# EAGLE board EBook (EAGLE 9.7.0)
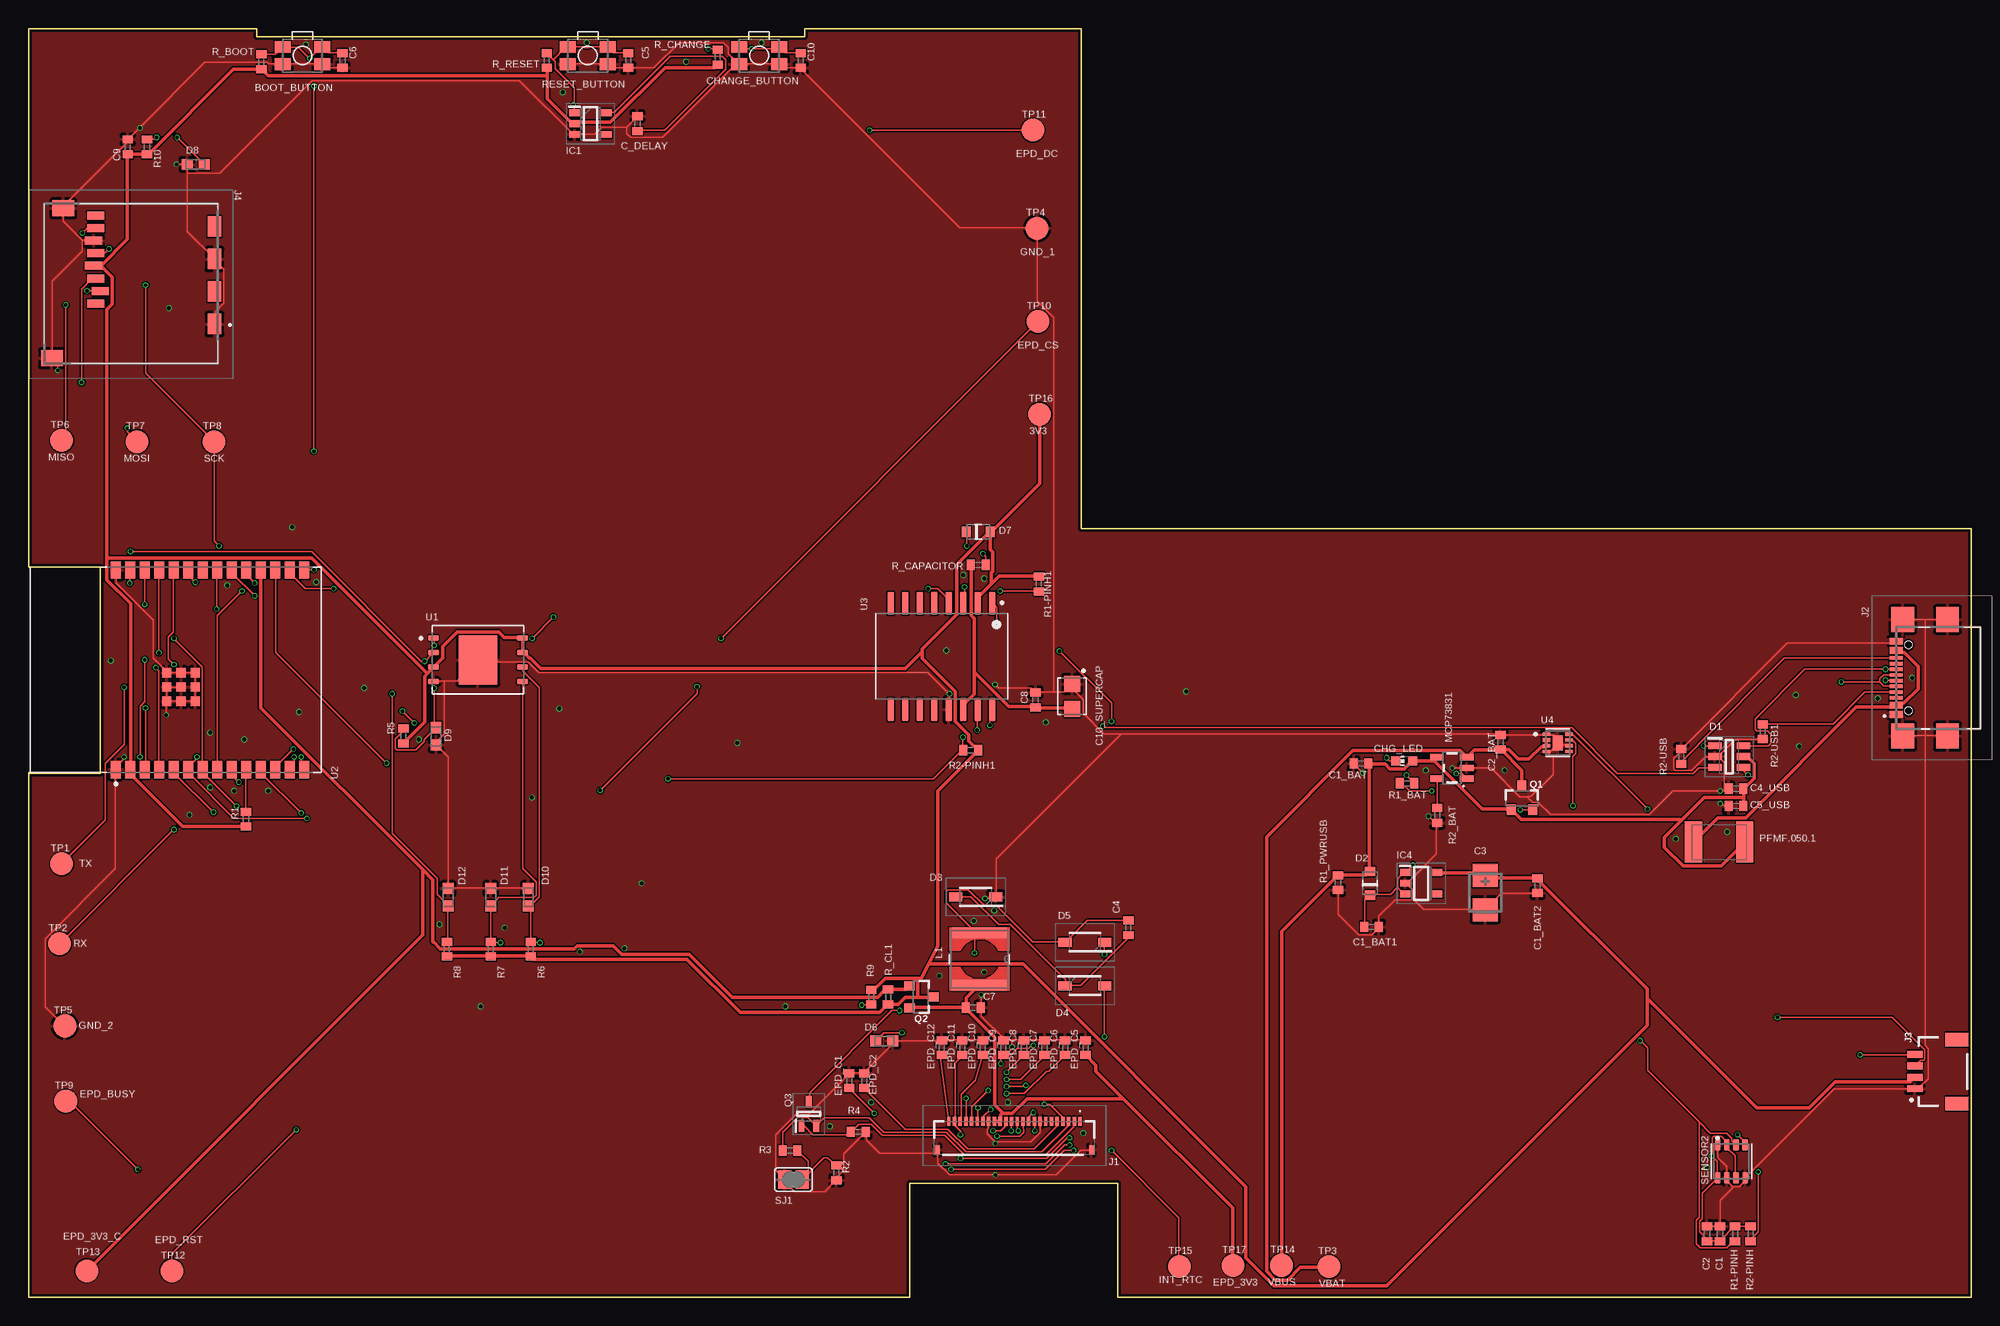
[diagram p1: board, top side]
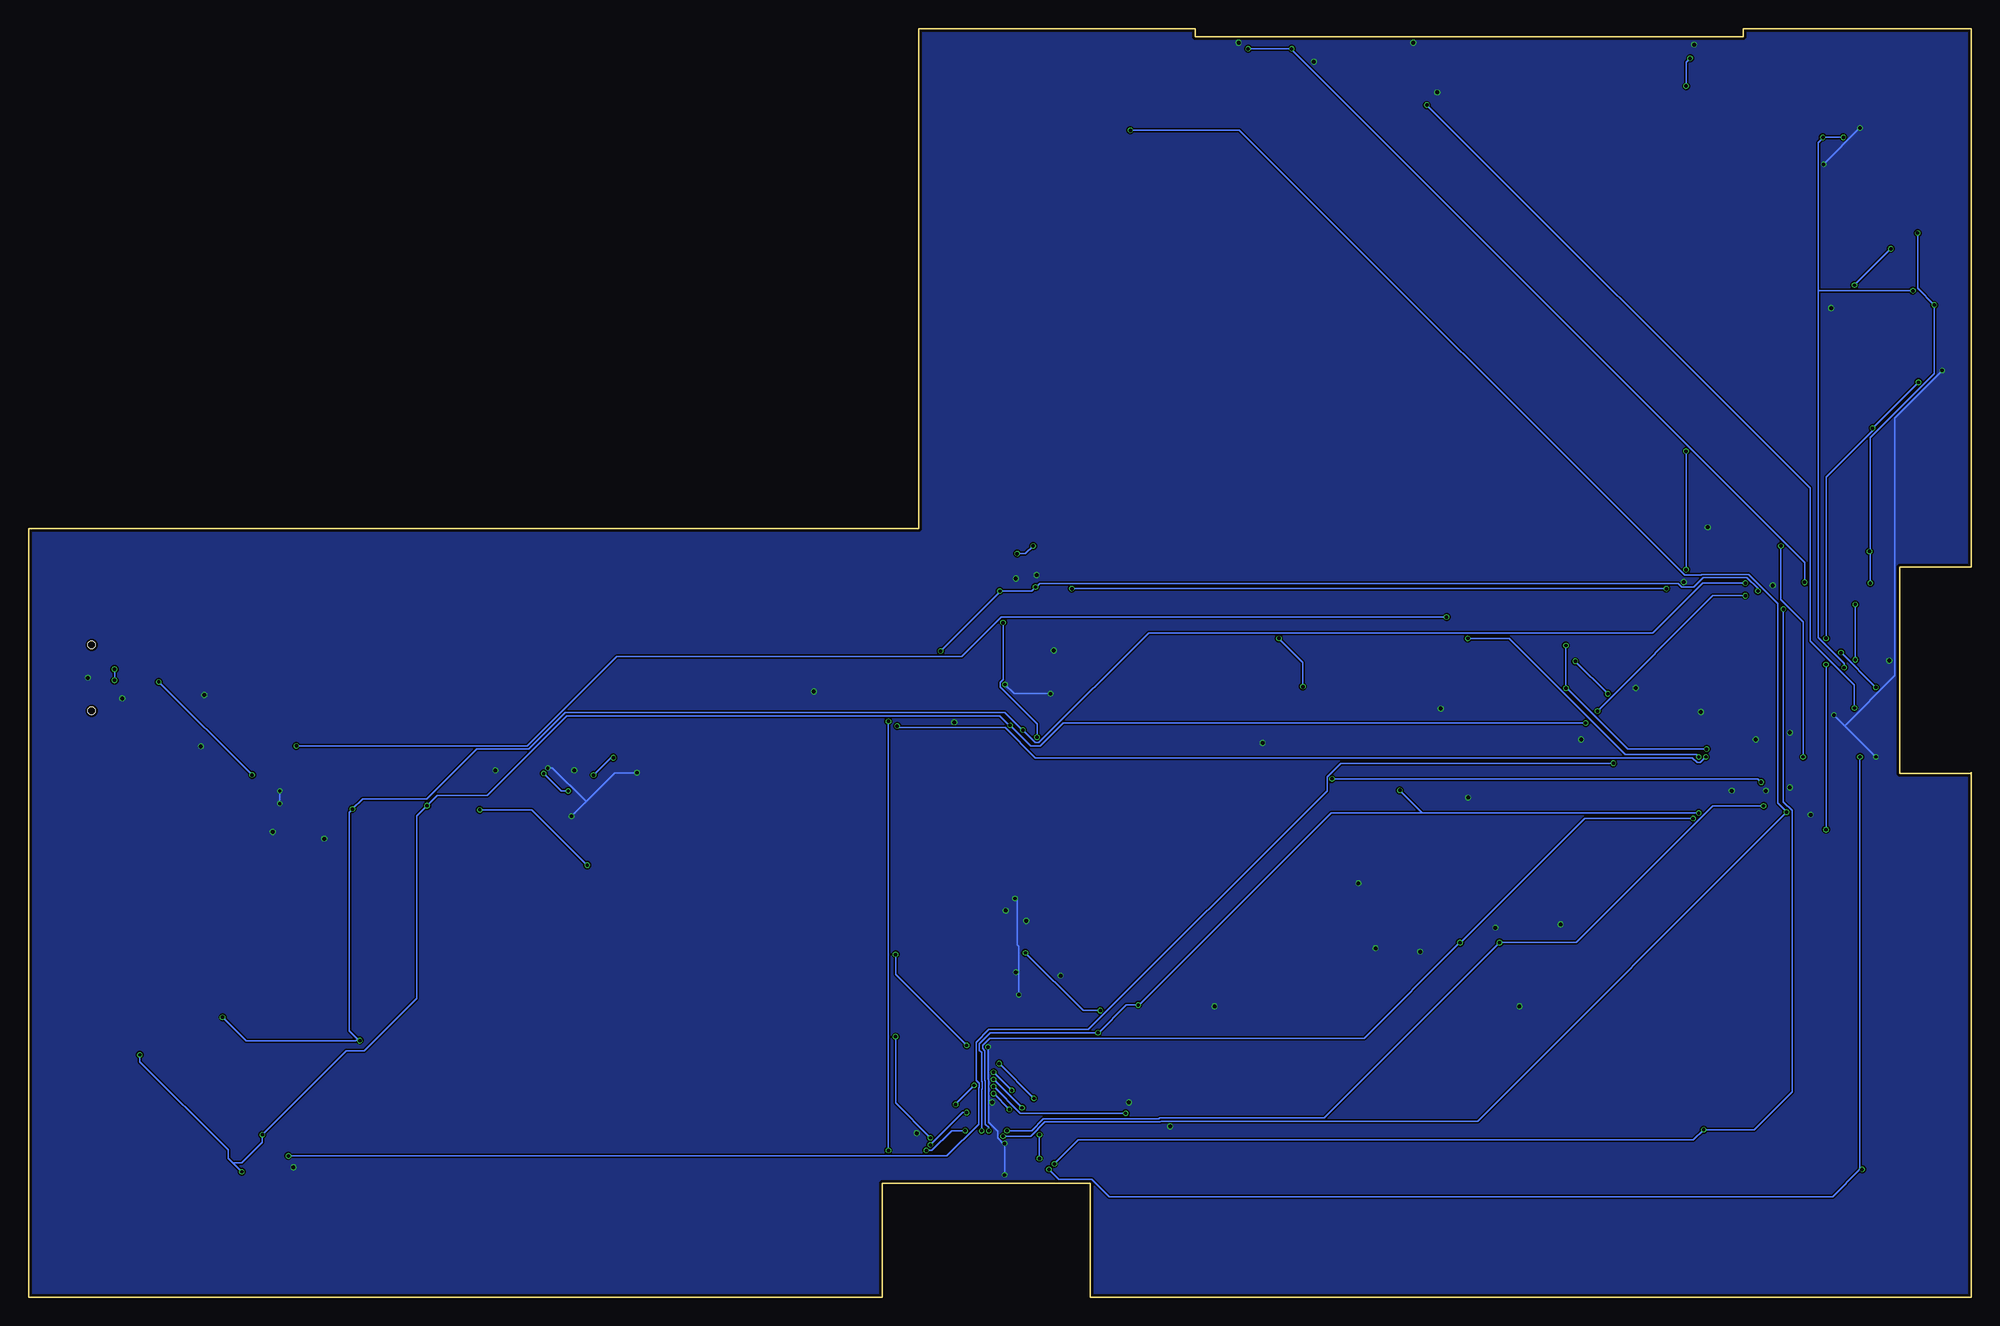
[diagram p2: board, bottom side, seen from below]

Size 170.2 x 111.2 mm. Coordinates in mm from the lower left corner, seen from the top.
Outline: 0,45.9 0,0 77.21,0 77.21,10 95.4,10 95.4,0 170.2,0 170.2,67.4 92.2,67.4 92.2,111.2 68,111.2 68,110.49 20,110.49 20,111.2 0,111.2 0,64 6.3,64 6.3,45.9 0,45.9
Outline: 0,45.9 0,46
Copper layers (1*16): Top 0.035mm / dielectric 1.6mm / Bottom 0.035mm
Design rules "jlcpcb-2layers.dru *": minimum track width 0.15mm, minimum drill 0.3mm, track to track 5mil, track to pad 5mil, pad to pad 5mil, via to via 5mil, smd to smd 5mil, copper to edge 0.2mm, drill to drill 6mil, minimum pad ring 10mil, minimum via ring 3mil, stop-mask expansion 4mil, vias tented up to drill 0mil, thermal gap 10mil
Net classes: 1 new_netclass: width 0.3 mm

## Footprints (pad centres in the part's own frame; a part is rotated, then mirrored left to right if it is on the bottom)
MYBUTTON = smd 1.4 x 1.05: 1 1.75,0.75; 2 -1.75,0.75; 3 -1.75,-0.75; 4 1.75,-0.75
EAGLE-LTSPICE_C0402 = smd 0.7 x 0.9: 1 -0.65,0; 2 0.65,0
RCL_CT3528 = smd 2 x 2.2: + -1.5,0; - 1.5,0
CAPCP3225X100N = smd 1.4 x 1.4: 1 -1.1,0; 2 1.1,0
ADAFRUIT_CHIP-LED0603 = smd 0.8 x 0.8: A 0,-0.75; C 0,0.75
SOT95P280X145-6N = smd 1.2 x 0.6: 1 -1.25,0.95; 2 -1.25,0; 3 -1.25,-0.95; 4 1.25,-0.95; 5 1.25,0; 6 1.25,0.95
ESP32_WROVER_AVX---SD0805S020S1R0_AVX_SD0805S020S1R0_0 = smd 0.8 x 0.9: 1 -1.05,0; 2 1.05,0
SOD3716X135N = smd 1.15 x 0.8: 1 -1.75,0; 2 1.75,0
DIOC1608X36N = smd 0.97 x 0.94: 1 -0.75,0; 2 0.75,0
SOT95P280X125-5N = smd 0.9 x 0.6: 1 -1.4,0.95; 2 -1.4,0; 3 -1.4,-0.95; 4 1.4,-0.95; 5 1.4,0.95
SOT95P280X120-5N = smd 0.9 x 0.6: 1 -1.4,0.95; 2 -1.4,0; 3 -1.4,-0.95; 4 1.4,-0.95; 5 1.4,0.95
FH34SRJ24S05SH99 = smd 0.3 x 0.8: 1 5.75,1.45; 2 5.25,1.45; 3 4.75,1.45; 4 4.25,1.45; 5 3.75,1.45; 6 3.25,1.45; 7 2.75,1.45; 8 2.25,1.45; 9 1.75,1.45; 10 1.25,1.45; 11 0.75,1.45; 12 0.25,1.45; 13 -0.25,1.45; 14 -0.75,1.45; 15 -1.25,1.45; 16 -1.75,1.45; 17 -2.25,1.45; 18 -2.75,1.45; 19 -3.25,1.45; 20 -3.75,1.45; 21 -4.25,1.45; 22 -4.75,1.45; 23 -5.25,1.45; 24 -5.75,1.45 | smd 0.4 x 0.8: MP1 6.75,-1.05; MP2 -6.75,-1.05
SAMACSYS_PARTS_USB4110GFA = smd 0.3 x 1.15: A1 -3.35,3.678; A4 -2.55,3.678; A5 -1.25,3.678; A6 -0.25,3.678; A7 0.25,3.678; A8 1.25,3.678; A9 2.55,3.678; A12 3.35,3.678; B1 3.05,3.678; B4 2.25,3.678; B5 1.75,3.678; B6 0.75,3.678; B7 -0.75,3.678; B8 -1.75,3.678; B9 -2.25,3.678; B12 -3.05,3.678 | smd 2.18 x 2: MP1 -5.11,-0.827; MP2 5.11,-0.827; MP3 -5.11,3.103; MP4 5.11,3.103 | hole 0.65: -2.89,2.603; 2.89,2.603
JST04_1MM_RA = smd 0.6 x 1.35: 1 -1.5,0; 2 -0.5,0; 3 0.5,0; 4 1.5,0 | smd 1.2 x 2: NC1 2.8,-3.675; NC2 -2.8,-3.675
112ATAARR03ATTEND = smd 1.8 x 1.2: G1 10.6,10.4; G2 4.9,10.4; S1 7.75,10.4; S2 2.05,10.4 | smd 1.4 x 1.9: G3 13.6,-3.85; G4 0.45,-2.85 | smd 0.7 x 1.5: P1 8.8,0; P2 7.7,0.4; P3 6.6,0; P4 5.5,-0.2; P5 4.4,0; P6 3.3,-0.2; P7 2.2,0; P8 1.1,0
IND_4828-WE-TPC_WRE = smd 0.889 x 4.826: 1 -2.286,0; 2 2.286,0
ESP32_WROVER_SPARKFUN-IC-POWER_SOT23-5 = smd 0.55 x 1.2: 1 -0.95,-1.3; 2 0,-1.3; 3 0.95,-1.3; 4 0.95,1.3; 5 -0.95,1.3
ESP32C6_VARISTOR_CT/CN1812 = smd 1.5 x 3.6: 1 -2.25,0; 2 2.25,0
ESP32_WROVER_SPARKFUN-DISCRETESEMI_SOT23-3 = smd 0.8 x 0.9: 1 -0.95,-1; 2 0.95,-1; 3 0,1.1
SOT65P210X110-3N = smd 1.05 x 0.5: 1 -1.05,0.65; 2 -1.05,-0.65; 3 1.05,0
ESP32_WROVER_EAGLE-LTSPICE_R0402 = smd 0.7 x 0.9: 1 -0.65,0; 2 0.65,0
ESP32_WROVER_BME680_PSON80P300X300X100-8N = smd 1.016 x 0.5: 1 1.458,1.2; 2 1.458,0.4; 3 1.458,-0.4; 4 1.458,-1.2; 5 -1.458,-1.22; 6 -1.458,-0.4; 7 -1.458,0.4; 8 -1.458,1.2
SJ = smd 1.168 x 1.6: 1 -0.762,0; 2 0.762,0
TP20R = smd 2 x 2: TP 0,0
SON127P600X800X80-9N = smd 0.94 x 0.44: 1 -3.895,1.905; 2 -3.895,0.635; 3 -3.895,-0.635; 4 -3.895,-1.905; 5 3.895,-1.905; 6 3.895,-0.635; 7 3.895,0.635; 8 3.895,1.905 | smd 3.4 x 4.3: 9 0,0
XCVR_ESP32-C6-WROOM-1-N8 = smd 1.5 x 0.9: 1 -8.75,5.26; 2 -8.75,3.99; 3 -8.75,2.72; 4 -8.75,1.45; 5 -8.75,0.18; 6 -8.75,-1.09; 7 -8.75,-2.36; 8 -8.75,-3.63; 9 -8.75,-4.9; 10 -8.75,-6.17; 11 -8.75,-7.44; 12 -8.75,-8.71; 13 -8.75,-9.98; 14 -8.75,-11.25; 15 8.75,-11.25; 16 8.75,-9.98; 17 8.75,-8.71; 18 8.75,-7.44; 19 8.75,-6.17; 20 8.75,-4.9; 21 8.75,-3.63; 22 8.75,-2.36; 23 8.75,-1.09; 24 8.75,0.18; 25 8.75,1.45; 26 8.75,2.72; 27 8.75,3.99; 28 8.75,5.26 | smd 0.8 x 0.8: 29_1 -2.755,0.79; 29_2 -1.505,0.79; 29_3 -0.255,0.79; 29_4 -2.755,-0.46; 29_5 -1.505,-0.46; 29_6 -0.255,-0.46; 29_7 -2.755,-1.71; 29_8 -1.505,-1.71; 29_9 -0.255,-1.71
SOIC127P1032X265-16N = smd 2.05 x 0.59: 1 -4.655,4.445; 2 -4.655,3.175; 3 -4.655,1.905; 4 -4.655,0.635; 5 -4.655,-0.635; 6 -4.655,-1.905; 7 -4.655,-3.175; 8 -4.655,-4.445; 9 4.655,-4.445; 10 4.655,-3.175; 11 4.655,-1.905; 12 4.655,-0.635; 13 4.655,0.635; 14 4.655,1.905; 15 4.655,3.175; 16 4.655,4.445
SON50P200X200X80-9N = smd 0.76 x 0.27: 1 -0.985,0.75; 4 -0.985,-0.75; 5 0.985,-0.75; 6 0.985,-0.25; 7 0.985,0.25; 8 0.985,0.75 | smd 0.76 x 0.31: 2 -0.985,0.25; 3 -0.985,-0.25 | smd 0.9 x 1.3: 9 0,0

## Placement (x,y rotation side)
BOOT_BUTTON  BUTTON_CUSYOMV1  [MYBUTTON]  24,108.83 180 top
C1  100nF  [EAGLE-LTSPICE_C0402]  148.17,5.58 90 top
C1_BAT  4.7uF  [EAGLE-LTSPICE_C0402]  116.73,46.8 180 top
C1_BAT1  4.7uF  [EAGLE-LTSPICE_C0402]  117.64,32.48 0 top
C1_BAT2  4.7uF  [EAGLE-LTSPICE_C0402]  132.18,36.08 270 top
C2  100nF  [EAGLE-LTSPICE_C0402]  147.03,5.58 90 top
C2_BAT  4.7uF  [EAGLE-LTSPICE_C0402]  128.94,48.66 90 top
C3  100uF TANT  [RCL_CT3528]  127.61,35.47 270 top
C4  4.7uF/25V  [EAGLE-LTSPICE_C0402]  96.35,32.4 90 top
C4_USB  100nF  [EAGLE-LTSPICE_C0402]  149.57,44.58 180 top
C5  1uF  [EAGLE-LTSPICE_C0402]  52.54,108.4 270 top
C5_USB  4.7uF  [EAGLE-LTSPICE_C0402]  149.57,43.08 180 top
C6  100nF  [EAGLE-LTSPICE_C0402]  27.5,108.4 270 top
C7  10uF  [EAGLE-LTSPICE_C0402]  82.75,25.4 0 top
C8  100nF  [EAGLE-LTSPICE_C0402]  88.21,52.37 90 top
C9  100nF  [EAGLE-LTSPICE_C0402]  8.7,100.83 90 top
C10  100nF  [EAGLE-LTSPICE_C0402]  67.64,108.4 270 top
C10_SUPERCAP  CPH3225A  [CAPCP3225X100N]  91.42,52.67 270 top
C_DELAY  100nF  [EAGLE-LTSPICE_C0402]  53.34,102.87 90 top
CHANGE_BUTTON  BUTTON_CUSYOMV1  [MYBUTTON]  64,108.83 180 top
CHG_LED  [ADAFRUIT_CHIP-LED0603]  120.51,47.01 90 top
D1  USBLC6-2SC6Y  [SOT95P280X145-6N]  148.98,47.4 0 top
D2  ESP32_WROVER_AVX---SD0805S020S1R0_AVX_SD0805S020S1R0_0_0AVX_SD0805S020S1R0_0_0  [ESP32_WROVER_AVX---SD0805S020S1R0_AVX_SD0805S020S1R0_0]  117.51,36.3 90 top
D3  MBR0530  [SOD3716X135N]  82.98,35.11 180 top
D4  MBR0530  [SOD3716X135N]  92.54,27.32 0 top
D5  MBR0530  [SOD3716X135N]  92.54,31.13 180 top
D6  PGB1010603MR  [DIOC1608X36N]  74.97,22.48 180 top
D7  ESP32_WROVER_AVX---SD0805S020S1R0_AVX_SD0805S020S1R0_0_0AVX_SD0805S020S1R0_0_0  [ESP32_WROVER_AVX---SD0805S020S1R0_AVX_SD0805S020S1R0_0]  83.2,67.1 0 top
D8  PGB1010603MR  [DIOC1608X36N]  14.65,99.28 0 top
D9  PGB1010603MR  [DIOC1608X36N]  35.7,49.18 90 top
D10  PGB1010603MR  [DIOC1608X36N]  43.78,35.08 270 top
D11  PGB1010603MR  [DIOC1608X36N]  40.49,35.08 270 top
D12  PGB1010603MR  [DIOC1608X36N]  36.77,35.08 270 top
EPD_C1  1uF/50V  [EAGLE-LTSPICE_C0402]  71.9,19 90 top
EPD_C2  1uF/50V  [EAGLE-LTSPICE_C0402]  73.2,19 90 top
EPD_C5  0.1uF/50V  [EAGLE-LTSPICE_C0402]  92.6,21.89 90 top
EPD_C6  1uF/50V  [EAGLE-LTSPICE_C0402]  90.8,21.89 90 top
EPD_C7  1uF/50V  [EAGLE-LTSPICE_C0402]  89,21.89 90 top
EPD_C8  1uF/50V  [EAGLE-LTSPICE_C0402]  87.2,21.89 90 top
EPD_C9  1uF/50V  [EAGLE-LTSPICE_C0402]  85.4,21.89 90 top
EPD_C10  1uF/50V  [EAGLE-LTSPICE_C0402]  83.6,21.89 90 top
EPD_C11  1uF/50V  [EAGLE-LTSPICE_C0402]  81.8,21.89 90 top
EPD_C12  1uF/50V  [EAGLE-LTSPICE_C0402]  80.01,21.89 90 top
IC1  BD5229G-TR  [SOT95P280X125-5N]  49.23,102.87 0 top
IC4  XC6220A331MR-G  [SOT95P280X120-5N]  122,36.3 0 top
J1  FH34SRJ-24S-0.5SH_99_  [FH34SRJ24S05SH99]  86.36,13.97 0 top
J2  SAMACSYS_PARTS_USB4110-GF-A  [SAMACSYS_PARTS_USB4110GFA]  167.28,54.3 90 top
J3  QWIIC_RIGHT_ANGLE  [JST04_1MM_RA]  165.25,19.8 90 top
J4  112A-TAAR-R03_ATTEND  [112ATAARR03ATTEND]  5.89,95.9 270 top
L1  68uH  [IND_4828-WE-TPC_WRE]  83.3,29.65 270 top
MCP73831  ESP32_WROVER_SPARKFUN-IC-POWER_MCP73831  [ESP32_WROVER_SPARKFUN-IC-POWER_SOT23-5]  124.69,46.4 90 top
PFMF.050.1  ESP32C6_VARISTORCN1812  [ESP32C6_VARISTOR_CT/CN1812]  148.1,39.91 0 top
Q1  20V/4.2A/52mΩ/1.4W  [ESP32_WROVER_SPARKFUN-DISCRETESEMI_SOT23-3]  130.82,43.74 0 top
Q2  20V/4.2A/52mΩ/1.4W  [ESP32_WROVER_SPARKFUN-DISCRETESEMI_SOT23-3]  78.17,26.34 270 top
Q3  SI1308EDL-T1-GE3  [SOT65P210X110-3N]  68.35,16.08 90 top
R1  10K  [ESP32_WROVER_EAGLE-LTSPICE_R0402]  19.05,41.91 90 top
R1-PINH  10K  [ESP32_WROVER_EAGLE-LTSPICE_R0402]  149.49,5.58 90 top
R1-PINH1  10K  [ESP32_WROVER_EAGLE-LTSPICE_R0402]  88.51,62.53 90 top
R1_BAT  200  [ESP32_WROVER_EAGLE-LTSPICE_R0402]  120.75,45.06 0 top
R1_PWRUSB  100K  [ESP32_WROVER_EAGLE-LTSPICE_R0402]  114.71,36.35 90 top
R2  2.2  [ESP32_WROVER_EAGLE-LTSPICE_R0402]  70.77,10.93 90 top
R2-PINH  10K  [ESP32_WROVER_EAGLE-LTSPICE_R0402]  150.85,5.58 90 top
R2-PINH1  10K  [ESP32_WROVER_EAGLE-LTSPICE_R0402]  82.53,47.96 0 top
R2-USB  5k1  [ESP32_WROVER_EAGLE-LTSPICE_R0402]  144.78,47.4 90 top
R2-USB1  5k1  [ESP32_WROVER_EAGLE-LTSPICE_R0402]  151.92,49.58 90 top
R2_BAT  2K  [ESP32_WROVER_EAGLE-LTSPICE_R0402]  123.4,42.24 90 top
R3  0.47  [ESP32_WROVER_EAGLE-LTSPICE_R0402]  66.71,12.87 0 top
R4  10K  [ESP32_WROVER_EAGLE-LTSPICE_R0402]  72.68,14.51 0 top
R5  10K  [ESP32_WROVER_EAGLE-LTSPICE_R0402]  32.84,49.2 270 top
R6  10K  [ESP32_WROVER_EAGLE-LTSPICE_R0402]  44,30.52 270 top
R7  10K  [ESP32_WROVER_EAGLE-LTSPICE_R0402]  40.48,30.52 270 top
R8  10K  [ESP32_WROVER_EAGLE-LTSPICE_R0402]  36.65,30.52 270 top
R9  10K  [ESP32_WROVER_EAGLE-LTSPICE_R0402]  73.82,26.32 90 top
R10  10K  [ESP32_WROVER_EAGLE-LTSPICE_R0402]  10.38,100.83 270 top
R_BOOT  10K  [ESP32_WROVER_EAGLE-LTSPICE_R0402]  20.4,108.28 90 top
R_CAPACITOR  15  [ESP32_WROVER_EAGLE-LTSPICE_R0402]  83.2,64.2 0 top
R_CHANGE  10K  [ESP32_WROVER_EAGLE-LTSPICE_R0402]  60.38,108.7 90 top
R_CL1  10K  [ESP32_WROVER_EAGLE-LTSPICE_R0402]  75.3,26.34 90 top
R_RESET  10K  [ESP32_WROVER_EAGLE-LTSPICE_R0402]  45.4,108.4 90 top
RESET_BUTTON  BUTTON_CUSYOMV1  [MYBUTTON]  49,108.83 180 top
SENSOR2  ESP32_WROVER_BME680_BME680  [ESP32_WROVER_BME680_PSON80P300X300X100-8N]  149.17,11.93 90 top
SJ1  [SJ]  67.01,10.33 0 top
TP1  TPTP20R  [TP20R]  2.9,38 0 top
TP2  TPTP20R  [TP20R]  2.72,31 0 top
TP3  TPTP20R  [TP20R]  113.94,2.7 0 top
TP4  TPTP20R  [TP20R]  88.36,93.7 0 top
TP5  TPTP20R  [TP20R]  3.18,23.8 0 top
TP6  TPTP20R  [TP20R]  2.9,75.1 0 top
TP7  TPTP20R  [TP20R]  9.52,75 0 top
TP8  TPTP20R  [TP20R]  16.24,75 0 top
TP9  TPTP20R  [TP20R]  3.26,17.2 0 top
TP10  TPTP20R  [TP20R]  88.41,85.52 0 top
TP11  TPTP20R  [TP20R]  87.98,102.3 0 top
TP12  TPTP20R  [TP20R]  12.56,2.32 0 top
TP13  TPTP20R  [TP20R]  5.11,2.32 0 top
TP14  TPTP20R  [TP20R]  109.76,2.82 0 top
TP15  TPTP20R  [TP20R]  100.81,2.72 0 top
TP16  TPTP20R  [TP20R]  88.58,77.4 0 top
TP17  TPTP20R  [TP20R]  105.53,2.8 0 top
U1  W25Q512JVEIQ  [SON127P600X800X80-9N]  39.37,55.88 0 top
U2  ESP32-C6-WROOM-1-N8  [XCVR_ESP32-C6-WROOM-1-N8]  12.9,55 90 top
U3  DS3231SN#  [SOIC127P1032X265-16N]  79.99,56.18 270 top
U4  MAX17048G+T10  [SON50P200X200X80-9N]  133.96,48.6 0 top

## Tracks (layer width: path | path; a pad name or v marks a point on that pad's centre or on a via)
3V3
  Top 0.3: 45.43,107.06 45.43,107.68 R_RESET.1 | 45.43,107.06 45.43,105.05 47.58,102.91 47.78,102.91 IC1.2 47.92,102.97 50.97,102.97 55.77,107.77 60.1,107.77 R_CHANGE.1 | 43.28,56.6 43.28,57.76 U1.8 43.14,57.82 41.69,57.82 41.2,58.31 37.53,58.31 36.29,57.06 36.29,56.02 35.59,55.33 U1.3 35.46,55.19 34.94,54.67 | 43.28,56.6 43.28,56.58 U1.7 | 34.94,54.67 34.69,54.43 34.69,50.41 32.89,48.61 R5.2 | R1.1 19.04,41.27 13.5,41.27 8.93,45.84 8.93,46.19 U2.2 8.93,46.4 8.93,60.8 6.86,62.88 6.86,64.82 | 6.86,64.82 6.86,86.56 7.34,87.05 7.34,89.4 6.44,90.3 J4.P4 5.75,90.44 6.37,90.44 8.66,92.73 8.66,100.07 C9.1 8.73,100.2 10.32,100.2 R10.2 10.53,100.2 17.94,107.61 20.36,107.61 R_BOOT.1 20.5,107.55 20.98,107.06 45.43,107.06 | 34.94,54.67 24.79,64.82 6.86,64.82 | IC4.5 123.4,37.19 127.35,37.19 127.56,36.98 C3.+ 127.7,36.91 127.83,36.77 132.13,36.77 C1_BAT2.1 132.18,36.62 141.78,27.02 141.78,26.22 | 141.78,26.22 151.38,16.62 156.01,16.62 158.26,18.88 164.83,18.88 J3.2 | R8.2 36.7,29.92 40.44,29.92 R7.2 40.58,29.92 43.97,29.92 R6.2 44.23,29.64 57.68,29.64 62.35,24.97 74.56,24.97 75.21,25.62 R_CL1.1 75.34,25.69 76.17,25.69 76.8,26.32 77.91,26.32 | 77.91,26.32 79.22,26.32 Q2.3 | 77.77,27.98 78.22,27.98 78.84,29.22 | 77.77,27.98 75.07,27.98 74.1,27.01 73.82,27.01 R9.2 | 77.77,27.98 77.91,27.84 77.91,26.32 | D7.2 84.21,67.1 81.32,64.22 81.32,59.86 78.3,56.84 78.3,56.6 | R1-PINH1.2 88.5,63.23 85.04,63.23 84.35,62.53 | TP16.TP 88.57,77.35 88.57,71.33 84.42,67.17 D7.2 | 84.35,62.53 83.17,61.35 83.17,60.87 U3.2 | 78.84,29.22 79.64,30.82 79.64,44.39 83.1,47.85 R2-PINH1.2 82.36,48.78 82.36,49.31 81.2,50.47 81.2,53.1 78.3,55.99 78.3,56.6
  Top 0.3: 78.84,29.22 87.12,29.22 106.64,9.7 106.64,3.46 109.07,1.04 118.99,1.04 141.78,23.82 141.78,26.22 | 84.35,62.53 84.35,63.51 84.48,63.63 84.48,65.33 84.25,65.55 D7.2 | 43.28,56.6 43.86,56.02 43.93,56.02 44.85,55.1 76.8,55.1 78.3,56.6
32KHZ  (via drill 0.3)
  Top 0.15: v81.85,49.1 81.85,47.99 R2-PINH1.1 81.78,47.99 79.25,45.45 v56.02,45.45 | v84.83,59.14 84.83,60.45 84.48,60.8 U3.1 | v18.42,45.15 17.87,45.7 17.87,46.19 U2.9
  Bottom 0.15: v81.85,49.1 81.85,50.28 85.1,53.52 85.1,53.89 84.83,54.16 v84.83,59.14 | v56.02,45.45 18.72,45.45 v18.42,45.15
DN  (via drill 0.3)
  Top 0.15: 162.18,53.95 162.53,53.6 163.57,53.6 J2.B7 | 162.18,53.95 162.18,54.22 162.53,54.57 163.57,54.57 J2.A7 | v150.62,45.77 150.27,46.12 150.27,46.4 D1.4 | 162.18,53.95 v158.79,53.95
  Bottom 0.15: v158.79,53.95 v150.62,45.77
DP  (via drill 0.3)
  Top 0.15: v162.67,54.08 163.57,54.08 J2.A6 | J2.B6 163.57,55.05 v162.67,55.05 155.6,55.05 151.24,50.69 151.24,49.79 151.38,49.65 152.35,49.65 152.63,49.38 152.63,48.54 152.42,48.34 150.27,48.34 D1.6
  Bottom 0.15: v162.67,55.05 v162.67,54.08
EPD_3V3
  Top 0.3: Q2.2 77.21,25.41 82.06,25.41 C7.1 | C7.1 82.13,25.55 82.13,26.25 83.24,27.35 L1.2 | J1.16 84.62,15.44 85.11,15.44 J1.15 85.18,15.58 85.18,16 85.32,16.14 | EPD_C5.1 93.5,20.34 93.5,19.82 95.9,17.41 | 95.9,17.41 105.47,7.85 105.47,2.84 TP17.TP | C7.1 82.13,25.28 84.62,22.78 84.62,16.9 85.25,16.27 85.32,16.14 | 95.9,17.41 87.47,17.41 86.19,16.14 85.32,16.14
EPD_3V3_C
  Top 0.3: Q2.1 77.14,27.29 76.87,27.01 75.34,27.01 R_CL1.2 75.21,26.87 74.93,26.87 74.37,26.32 61.63,26.32 57.88,30.07 51.98,30.07 51.23,30.83 48.08,30.83 47.8,30.54 36.09,30.54 35.49,31.14 35.43,31.14 35.43,36.59 34.53,37.49 | 34.53,37.49 20.36,51.66 20.36,63.71 U2.18 | 34.53,37.49 34.53,31.76 5.12,2.35 TP13.TP
EPD_BUSY  (via drill 0.3)
  Top 0.15: v88.16,14.61 88.16,15.37 J1.9 | v91.55,12.88 90.72,12.88 89.06,11.22 v80.81,11.22 | v9.58,11.22 3.83,16.97 TP9.TP | v10.18,60.73 10.18,63.71 U2.26 | v10.18,55.88 10.18,52.22 9.76,51.8 v9.76,47.37
  Bottom 0.15: v88.16,14.61 89.33,14.61 91.06,12.88 v91.55,12.88 | v9.58,11.22 9.76,11.22 | v10.18,55.88 v10.18,60.73 | 9.76,11.22 v9.76,47.37 | v80.81,11.22 79.95,10.35 77.06,10.35 75.53,8.82 12.16,8.82 9.76,11.22
EPD_CS  (via drill 0.3)
  Top 0.15: v86.7,14.61 86.63,14.68 86.63,15.37 J1.12 | v76.52,23.2 74.93,23.2 74.24,22.51 D6.2 | v72.99,25.62 73.75,25.62 R9.1 | v23.89,42.45 20.36,45.98 20.36,46.19 U2.11 | v60.66,57.76 88.36,85.45 TP10.TP | v58.56,53.53 58.56,52.93 v50.07,44.44
  Bottom 0.15: 48.11,42.45 56.09,42.45 72.92,25.62 v72.99,25.62 74.03,25.62 76.45,23.2 v76.52,23.2 85.94,23.2 86.91,22.23 86.91,21.68 86.7,21.47 86.7,18.93 86.66,18.88 86.66,18.3 86.7,18.25 v86.7,14.61 | 48.11,42.45 v23.89,42.45 | v60.66,57.76 58.56,55.65 v58.56,53.53 | v50.07,44.44 48.11,42.47 48.11,42.45
EPD_DC  (via drill 0.3)
  Top 0.15: v84.83,14.13 86.84,14.13 87.19,14.47 87.19,14.75 87.12,14.82 87.12,15.37 J1.11 | v16.2,42.52 12.74,45.98 12.74,46.19 U2.5 | v73.68,102.28 87.95,102.28 TP11.TP
  Bottom 0.15: v84.83,14.13 82.41,14.13 81.16,15.37 71.07,15.37 70.99,15.45 43.27,15.45 v16.2,42.52 16.2,42.59 16.97,43.35 16.97,60.8 19.53,63.36 23.61,63.36 23.68,63.29 25.14,63.29 64.13,102.28 v73.68,102.28
EPD_RST  (via drill 0.3)
  Top 0.15: v88.02,16.2 87.67,15.86 87.67,15.44 J1.10 | v91.2,13.37 90.79,13.37 89.12,11.7 v80.33,11.7 | v23.45,14.7 12.56,3.81 TP12.TP | v16.48,60.32 16.48,63.71 U2.21
  Bottom 0.15: v88.02,16.2 88.36,16.2 v91.2,13.37 | v80.33,11.7 78.23,13.8 24.35,13.8 v23.45,14.7 19.02,14.7 15.72,18 15.72,42.66 16.48,43.42 v16.48,60.32
FLASH_CS  (via drill 0.3)
  Top 0.15: R5.1 32.83,49.79 32.83,49.65 32.13,48.96 32.13,48.13 32.27,47.99 33.93,47.99 34.65,48.71 34.65,48.88 D9.2 35.66,50 35.52,50.14 v35.52,53.39 | v35.52,57.13 35.52,57.76 U1.1 | v23.2,48.06 21.68,46.54 21.68,46.26 U2.12
  Bottom 0.15: v35.52,57.13 v35.52,53.39 35.46,53.39 30.12,48.06 v23.2,48.06
GDR
  Top 0.15: J1.2 91.55,15.37 91.55,14.96 89.06,12.46 81.99,12.46 80.26,14.2 74.79,14.2 73.82,15.17 72.71,15.17 72.09,14.54 R4.1 72.02,14.47 71.81,14.27 68.7,14.27 67.93,15.03 67.73,15.03 Q3.1
GND  (via drill 0.3, 0.35)
  Top 0.15: U2.29_1 12.12,52.28 12.12,53.46 U2.29_2 12.19,53.46 13.3,53.46 U2.29_5 | U2.29_1 12.19,52.28 13.3,52.28 U2.29_4 13.37,52.28 14.54,52.28 U2.29_7 14.61,52.28 14.61,53.46 U2.29_8 14.61,53.53 14.61,54.71 U2.29_9 14.54,54.78 13.37,54.78 U2.29_6 13.3,54.78 12.12,54.78 U2.29_3 12.12,54.85 10.94,56.02 10.94,59.35 7.69,62.6 7.69,63.71 U2.28 | TP5.TP 3.12,23.82 1.45,25.48 1.45,31.44 7.62,37.6 7.62,46.19 U2.1 7.69,46.26 7.69,46.54 8.38,47.23 v8.38,47.37 | v12.05,51.04 12.05,52.22 U2.29_1 | 13.92,98.54 13.92,93.42 16.27,91.06 J4.G2 16.27,90.92 17.11,90.09 17.11,87.12 16.34,86.36 16.34,85.32 J4.G1 | 13.92,98.54 13.92,99.23 D8.1 13.85,99.31 v12.95,99.31 | C6.2 26.04,107.75 25.76,108.03 BOOT_BUTTON.2 25.69,108.1 22.3,108.1 BOOT_BUTTON.1 22.23,108.1 21.05,108.1 20.91,108.24 15.44,108.24 9.73,102.53 | 4.71,92.66 5.68,92.66 J4.P6 | 4.71,92.66 3.05,94.32 3.05,95.43 J4.G4 3.05,95.5 3.05,95.63 8.66,101.24 8.66,101.45 C9.2 8.73,101.52 9.73,102.53 | 4.71,92.66 4.71,91.69 2.08,89.06 2.08,82.34 J4.G3 2.08,82.27 2.56,81.78 v2.56,81.23 | v9.76,102.49 9.73,102.53 | 52.42,102.56 50.21,102.56 49.58,101.94 47.85,101.94 IC1.3 47.78,101.87 43,106.64 24.86,106.64 16.76,98.54 13.92,98.54 | 52.42,102.56 53.32,103.46 C_DELAY.2 | RESET_BUTTON.1 47.3,108.1 50.69,108.1 RESET_BUTTON.2 50.76,108.03 51.04,107.75 52.49,107.75 C5.2 52.56,107.75 54.78,107.75 56.99,109.97 60.87,109.97 61.29,109.55 61.29,109 62.19,108.1 CHANGE_BUTTON.1 | CHANGE_BUTTON.1 62.26,108.1 65.72,108.1 CHANGE_BUTTON.2 65.79,108.03 66.06,107.75 67.59,107.75 C10.2 67.66,107.68 81.58,93.76 88.29,93.76 TP4.TP 88.36,93.63 88.36,87.32 89.82,85.87 89.82,53.05
  Top 0.15: 52.42,102.56 52.42,102 52.77,101.66 55.54,101.66 62.05,108.17 CHANGE_BUTTON.1 | EPD_C10.2 83.58,22.58 81.85,22.58 EPD_C11.2 81.78,22.58 80.05,22.58 EPD_C12.2 79.98,22.51 75.76,22.51 D6.1 75.69,22.44 75.69,22.23 73.2,19.74 EPD_C2.2 73.2,19.67 71.95,19.67 EPD_C1.2 71.88,19.6 68.35,16.07 67.24,16.07 65.44,14.27 65.44,11.15 66.2,10.39 SJ1.1 66.27,10.32 66.27,10.11 67.1,9.28 69.73,9.28 70.7,10.25 R2.1 70.77,10.49 71.42,11.15 71.42,12.6 R4.2 73.45,13.76 74.56,12.65 79.34,12.65 J1.MP2 79.64,12.88 79.64,11.77 80.68,10.73 v84.69,10.73 90.03,10.73 92.17,12.88 93.07,12.88 J1.MP1 | 86.15,22.58 87.19,22.58 EPD_C8.2 87.25,22.58 88.99,22.58 EPD_C7.2 89.06,22.58 90.79,22.58 EPD_C6.2 90.86,22.58 92.59,22.58 EPD_C5.2 | 86.15,22.58 85.45,22.58 EPD_C9.2 85.45,22.64 83.45,24.65 83.45,25.35 C7.2 83.45,25.41 v83.45,26.52 | 84.69,13.64 84,14.34 84,14.75 84.07,14.82 84.07,15.37 J1.17 | 84.69,13.64 87.81,13.64 88.64,14.47 88.64,15.37 J1.8 | 84.69,13.64 v84.69,13.5 | v86.15,21.95 86.15,22.58 | D10.1 43.77,35.87 40.51,35.87 D11.1 40.44,35.87 36.77,35.87 D12.1 36.77,35.94 36.77,47.37 35.73,48.41 D9.1 35.73,48.48 35.73,48.68 36.42,49.38 36.42,54.02 | 36.42,54.02 37.53,54.02 39.33,55.82 U1.9 39.58,55.67 43.79,55.67 44.7,54.75 78.77,54.75 80.61,52.91 v80.68,52.91 80.68,51.59 U3.13 | 36.42,54.02 35.52,54.02 U1.4 | 89.82,53.05 90.72,53.05 91.41,53.74 C10_SUPERCAP.1 91.27,53.53 92.38,52.42 92.38,51.2 94.2,49.38 95.72,49.38 | 89.82,53.05 88.22,53.05 C8.2 88.16,53.05 87.81,53.39 84.99,53.39 v84.67,53.71 | 95.72,49.38 84.76,38.41 84.76,35.18 D3.1 84.69,35.11 84.55,34.97 v83.79,34.97
  Top 0.15: C1_BAT2.2 132.13,35.39 129.01,35.39 127.63,34 C3.- 127.56,34 122.23,34 121.33,34.9 121.26,34.9 | 121.26,34.9 121.26,35.73 120.63,36.36 IC4.2 120.77,36.29 123.33,38.85 123.33,41.55 R2_BAT.1 123.27,41.55 v122.64,42.17 | R1_PWRUSB.1 114.75,35.66 114.75,33.59 116.55,31.79 117.66,31.79 118.28,32.41 C1_BAT1.2 118.29,33.44 119.7,34.85 121.13,34.85 121.19,34.9 121.26,34.9 | v116.89,45.98 116.13,46.74 C1_BAT.2 | C2.2 147.09,6.23 148.13,6.23 C1.2 148.19,6.3 148.19,8.52 149.3,9.63 149.3,9.7 | 149.3,9.7 148.82,10.18 148.82,10.46 SENSOR2.7 148.75,10.53 148.75,11.49 147.99,12.26 147.99,13.37 SENSOR2.1 | 149.3,9.7 149.86,9.7 150.34,10.18 150.34,10.46 SENSOR2.5 150.41,10.53 158.17,18.28 165.23,18.28 J3.1 165.3,18.35 165.58,18.35 166.4,19.18 166.4,21.8 166.13,22.07 166.13,49.24 | J2.B12 163.64,51.24 163.64,50.97 J2.A1 163.64,50.9 163.64,49.72 164.12,49.24 J2.MP3 164.19,49.24 166.13,49.24 | 166.13,49.24 168.07,49.24 J2.MP1 | 166.13,59.42 164.19,59.42 J2.MP4 164.12,59.35 163.64,58.86 163.64,57.69 J2.A12 163.64,57.62 163.64,57.41 J2.B1 163.57,57.34 154.08,57.34 144.8,48.06 R2-USB.2 144.73,47.99 144.73,47.85 144.11,47.23 144.11,46.33 144.25,46.19 145.7,46.19 146.88,47.37 147.71,47.37 D1.2 | 166.13,59.42 168.07,59.42 J2.MP2 | 166.13,59.42 166.13,49.24 | v148.19,43.28 148.33,43.14 148.89,43.14 C5_USB.2 | 148.54,44.39 148.75,44.39 148.89,44.53 C4_USB.2 | 148.54,44.39 v148.19,44.39 144.04,44.39 141.96,42.31 133.33,42.31 132.25,43.39 131.79,43.39 131.3,43.88 | R2-USB1.1 151.87,48.89 149.51,48.89 148.06,47.44 147.78,47.44 D1.2 | 148.54,44.39 148.54,46.88 148.06,47.37 D1.2
  Top 0.15: U4.9 134,48.54 133.31,47.85 133.03,47.85 U4.4 133.56,47.27 133.56,45.84 131.6,43.89 131.3,43.89 131.3,43.88 | U4.9 134.22,48.69 133.61,49.31 133.03,49.31 U4.1 132.96,49.31 C2_BAT.2 128.87,49.38 95.72,49.38 | U4.6 134.9,48.41 134.21,48.41 134.07,48.54 U4.9 | 131.3,43.88 130.63,43.88 128.11,46.4 126.03,46.4 MCP73831.2 125.97,46.4 v124.72,46.4
  Bottom 0.15: v8.38,47.37 11.12,50.1 | 11.12,50.1 v12.05,51.04 | v9.76,102.49 v12.95,99.31 | 11.12,50.1 6.72,54.5 6.72,77.08 v2.56,81.23 | v84.69,10.73 v84.69,13.5 84.76,13.43 85.32,13.99 85.32,14.54 86.1,15.33 86.1,19.11 86.15,19.16 v86.15,21.95 | v80.68,52.91 83.86,52.91 v84.67,53.71 | v116.89,45.98 118.83,45.98 121.36,43.45 | v122.64,42.17 121.36,43.45 | v148.19,44.39 v148.19,43.28 | 121.36,43.45 124.3,46.4 v124.72,46.4 | v83.45,26.52 83.45,30.77 83.6,30.92 83.6,34.78 v83.79,34.97
  other vias: 39.6,25.5 53.7,36.3 101.4,53.1 62.1,48.6 46.5,51.6 129.3,46.2 89.1,50.4 23.1,67.5 12.3,86.7 92.4,14.4 18.9,48.9 29.4,53.4 23.7,51.3 14.1,42.3 21,44.4 15.9,49.5 18,44.4 15.9,44.7 34.2,48.9 44.1,43.8 7.2,55.8 46.8,105.6 80.4,56.7 83.7,63 81.9,63.3 79.8,28.2 83.7,28.5 82.8,33 84.6,33.9 66.3,25.5 52.2,30.6 48.3,30.3 41.7,32.4 36,32.7 17.4,62.4 25.2,62.7 24.3,109.8 48.9,109.96 64.2,109.96 57.6,108.3 154.8,52.8 155.1,48.3 144.3,40.2 148.8,40.8 162,52.5 165,54.3 122.4,46.2 147,11.4 73.8,17.1 85.8,17.1 70.2,15
  pour Top: 6.36,45.86 6.34,45.84 6.32,45.82 0.08,45.82 0.08,0.08 77.13,0.08 77.13,10.02 77.15,10.04 77.17,10.06 77.19,10.08 95.42,10.08 95.44,10.06 95.46,10.04 95.48,10.02 95.48,0.08 170.12,0.08 170.12,67.32 92.18,67.32 92.16,67.34 92.14,67.36 92.12,67.38 92.12,111.12 68.08,111.12 68.08,110.47 68.06,110.45 68.04,110.43 68.02,110.41 19.98,110.41 19.96,110.43 19.94,110.45 19.92,110.47 19.92,111.12 0.08,111.12 0.08,64.08 6.32,64.08 6.34,64.06 6.36,64.04 6.38,64.02 6.38,45.88
  pour Bottom: 6.36,45.86 6.34,45.84 6.32,45.82 0.08,45.82 0.08,0.08 77.13,0.08 77.13,10.02 77.15,10.04 77.17,10.06 77.19,10.08 95.42,10.08 95.44,10.06 95.46,10.04 95.48,10.02 95.48,0.08 170.12,0.08 170.12,67.32 92.18,67.32 92.16,67.34 92.14,67.36 92.12,67.38 92.12,111.12 68.08,111.12 68.08,110.47 68.06,110.45 68.04,110.43 68.02,110.41 19.98,110.41 19.96,110.43 19.94,110.45 19.92,110.47 19.92,111.12 0.08,111.12 0.08,64.08 6.32,64.08 6.34,64.06 6.36,64.04 6.38,64.02 6.38,45.88
GPIO8
  Top 0.15: R1.2 19.04,42.59 19.04,46.19 U2.10
I2C_PW  (via drill 0.3)
  Top 0.15: R2-PINH.2 150.83,6.23 149.51,6.23 R1-PINH.2 149.44,6.23 148.19,4.99 C1.1 148.13,4.99 147.09,4.99 C2.1 147.03,5.11 146.38,5.76 146.38,6.66 146.62,6.91 146.62,9.13 SENSOR2.8 147.92,10.53 147.92,11.91 147.5,12.33 147.5,12.4 | 147.5,12.4 147.5,13.99 147.64,14.13 148.26,14.13 148.75,13.64 148.75,13.43 SENSOR2.2 148.82,13.37 148.82,13.09 149.51,12.4 149.51,10.53 SENSOR2.6 | v31.37,46.81 21.68,56.51 21.68,63.71 U2.17 | v147.43,12.4 147.5,12.4
  Bottom 0.15: v147.43,12.4 89.75,12.4 86.98,15.17 86.98,18.37 86.93,18.41 86.93,18.77 87.19,19.02 87.19,22.37 86.08,23.48 77.37,23.48 56.45,44.4 56.45,45.63 55.27,46.81 v31.37,46.81
INT_RTC  (via drill 0.3)
  Top 0.15: v85.11,61.91 88.5,61.91 R1-PINH1.1 | v81.99,62.26 81.99,60.94 81.92,60.87 U3.3 | v18.7,61.91 16.55,59.76 16.55,46.26 U2.8 | v94.87,12.88 100.76,6.99 100.76,2.77 TP15.TP | v94.87,50.48 94.87,52.08 v90.3,56.65
  Bottom 0.15: v18.7,61.91 18.7,62.12 19.67,63.09 23.48,63.09 24.32,62.25 25.39,62.25 25.69,62.55 81.63,62.55 81.92,62.26 v81.99,62.26 82.34,61.91 v85.11,61.91 85.11,61.84 v90.3,56.65 | v94.87,50.48 v94.87,12.88
IO/BOOT  (via drill 0.3)
  Top 0.15: R_BOOT.2 20.43,108.93 21.61,108.93 22.23,109.55 BOOT_BUTTON.4 22.3,109.55 23.61,109.55 24.58,108.58 v24.65,108.58 25.69,109.62 BOOT_BUTTON.3 25.76,109.55 26.25,109.07 27.49,109.07 C6.1 | v25,63.78 24.17,63.78 U2.15 | v25,74.17 v25,106.16
  Bottom 0.15: v25,74.17 v25,63.78 | v25,106.16 25,108.24 v24.65,108.58
IO/CHANGE  (via drill 0.3)
  Top 0.15: C10.1 67.59,109.07 66.27,109.07 65.79,109.55 CHANGE_BUTTON.3 65.58,109.42 v63.36,109.42 62.39,109.42 62.26,109.55 CHANGE_BUTTON.4 | v59.55,109.42 60.32,109.42 R_CHANGE.2 | v14.61,62.67 14.06,63.23 14.06,63.71 U2.23
  Bottom 0.15: v63.36,109.42 v59.55,109.42 59.55,109.35 14.61,64.4 v14.61,62.67
MISO  (via drill 0.3)
  Top 0.15: R8.1 36.7,31.23 36.7,34.28 D12.2 35.78,35.32 35.78,36.74 31.86,40.66 v31.86,52.91 | U1.2 35.46,56.51 v34.69,55.75 34.42,55.75 24.79,65.37 v8.93,65.37 | v4.71,93.28 5.12,93.69 J4.P7 | v3.25,86.98 3.25,75.48 2.91,75.14 TP6.TP | v8.86,62.6 8.86,63.71 U2.27
  Bottom 0.15: v34.69,55.75 v31.86,52.91 | v4.71,93.28 4.71,88.43 v3.25,86.98 3.25,80.95 8.86,75.34 8.86,65.37 | 8.86,65.37 v8.86,62.6 | v8.93,65.37 8.86,65.37
MOSI  (via drill 0.3)
  Top 0.15: U1.5 43.28,53.95 43.28,37.6 44.46,36.42 44.46,35.25 44.25,35.04 41.2,35.04 40.51,34.35 D11.2 40.51,34.28 40.51,31.23 R7.1 40.51,31.16 40.58,31.09 v41.34,31.09 | v4.64,80.19 4.64,88.36 5.54,89.26 5.89,89.26 J4.P3 | v8.66,76.17 8.66,75.9 9.49,75.07 TP7.TP | v84.48,14.61 85.18,14.61 85.59,15.03 85.59,15.37 J1.14 | v18.21,43.07 15.3,45.98 15.3,46.19 U2.7 15.23,46.26 15.23,55.26 v12.74,57.76
  Bottom 0.15: v4.64,80.19 v8.66,76.17 8.66,75.97 12.74,71.88 v12.74,57.76 | v84.48,14.61 82.34,14.61 81.3,15.65 71.18,15.65 71.1,15.73 56.7,15.73 v41.34,31.09 34.62,31.09 22.64,43.07 v18.21,43.07
N$1
  Top 0.15: R2-USB.1 144.8,46.81 144.8,46.95 146.26,48.41 146.26,48.48 153.8,56.02 163.57,56.02 J2.B5
N$2  (via drill 0.3)
  Top 0.15: v84.28,16.48 83.65,15.86 83.65,15.44 J1.18 | v85.66,17.87 87.24,17.87 89.2,19.82 89.38,19.82 EPD_C6.1
  Bottom 0.15: v85.66,17.87 v84.28,16.48
N$3
  Top 0.15: R2-USB1.2 151.94,50.28 158.1,50.28 160.87,53.05 163.57,53.05 J2.A5
N$8  (via drill 0.3)
  Top 0.15: C1_BAT1.1 117.03,32.55 117.03,34.83 117.45,35.25 D2.1 117.52,35.32 119.32,35.32 119.87,35.87 119.94,35.87 | 119.94,35.87 120.43,35.39 120.56,35.39 IC4.3 | 119.94,35.87 119.94,36.7 120.43,37.19 120.56,37.19 IC4.1 120.63,37.26 v121.26,37.88 | v130.68,42.73 131.71,42.73 Q1.2
  Bottom 0.15: v130.68,42.73 126.1,42.73 v121.26,37.88
N$9
  Top 0.15: C4.1 96.33,31.72 96.33,31.51 92.17,27.35 90.86,27.35 D4.1 90.86,27.42 90.86,27.84 86.01,32.69 84.97,32.69 82.55,35.11 D3.2 | D3.2
N$10  (via drill 0.3)
  Top 0.15: v83.17,16.62 83.17,15.44 J1.19 | v85.66,19.11 86.91,19.11 88.99,21.19 EPD_C7.1
  Bottom 0.15: v85.66,19.11 v83.17,16.62
N$11
  Top 0.15: R2_BAT.2 123.4,42.94 123.4,45.43 MCP73831.5
N$12  (via drill 0.3)
  Top 0.15: v122.92,44.39 120.98,44.39 120.36,45.01 120.15,45.01 R1_BAT.1 | v125.07,45.91 125.55,45.91 125.97,45.5 MCP73831.1
  Bottom 0.15: v122.92,44.39 123.54,44.39 v125.07,45.91
N$13  (via drill 0.3)
  Top 0.15: v118.97,47.3 119.25,47.02 119.73,47.02 CHG_LED.C | v120.7,45.77 121.39,45.08 R1_BAT.2
  Bottom 0.15: v118.97,47.3 119.18,47.3 v120.7,45.77
N$14
  Top 0.15: C_DELAY.1 53.39,102.28 55.75,102.28 61.08,107.61 61.08,108.44 60.77,108.75 56.19,108.75 51.31,103.88 50.69,103.88 IC1.5
N$15
  Top 0.15: EPD_C10.1 82.92,19.02 81.7,17.81 81.7,15.51 J1.22
N$18
  Top 0.15: J1.5 90.09,15.37 90.09,15.03 88.09,13.02 82.27,13.02 80.54,14.75 76.8,14.75 73.27,18.28 EPD_C2.1
N$20  (via drill 0.3)
  Top 0.15: v82.2,65.86 82.2,67.03 D7.1 | v83.6,65.19 83.85,64.94 R_CAPACITOR.2
  Bottom 0.15: v82.2,65.86 82.87,65.19 v83.6,65.19
N$21
  Top 0.15: EPD_C12.1 79.86,21.09 J1.24
N$22  (via drill 0.3)
  Top 0.15: v84.07,18.14 82.61,16.69 82.61,15.44 J1.20 | v85.66,19.74 87.19,21.26 EPD_C8.1
  Bottom 0.15: v85.66,19.74 v84.07,18.14
N$23  (via drill 0.3)
  Top 0.15: v74.1,16.14 71.95,18.28 EPD_C1.1 | J1.4 90.58,15.44 90.58,15.79 89.45,16.91 v88.99,16.91 | v85.66,18.49 87.26,18.49 v87.36,18.59
  Bottom 0.15: v85.66,18.49 83.31,16.14 v74.1,16.14 | v88.99,16.91 88.99,16.97 v87.36,18.59
PREVGH  (via drill 0.3)
  Top 0.15: v82.13,17.45 82.13,15.44 J1.21 | v85.18,20.5 85.18,20.98 85.39,21.19 EPD_C9.1 85.45,21.26 86.08,21.26 86.63,21.81 87.6,21.81 87.88,22.09 v88.02,22.09 | v94.25,30.05 94.25,31.09 D5.1
  Bottom 0.15: v85.18,20.5 v82.13,17.45 | v94.25,30.05 94.25,28.32 v88.02,22.09
PREVGL  (via drill 0.3)
  Top 0.15: EPD_C11.1 81.78,21.19 81.16,20.57 81.16,15.44 J1.23 81.16,15.37 81.16,15.03 81.65,14.54 v81.65,14.27 | v94.25,22.85 94.25,27.29 D4.2 | v91.2,13.99 91,13.99 89.19,12.19 v81.65,12.19
  Bottom 0.15: v94.25,22.85 94.25,17.04 v91.2,13.99 | v81.65,12.19 v81.65,14.27
RESE
  Top 0.15: J1.3 91.06,15.37 91.06,15.03 88.78,12.74 82.13,12.74 80.4,14.47 74.93,14.47 73.65,15.75 69.7,15.75 69.04,15.1 Q3.2 68.97,15.1 68.28,15.79 67.38,15.79 66.06,14.47 R3.1
RESE'
  Top 0.15: R2.2 69.97,12.23 69.68,12.23 SJ1.2 68,11.08 67.73,11.08 67.68,11.04 68.28,10.43 68.28,11.95 R3.2
RESET  (via drill 0.3)
  Top 0.15: C5.1 52.49,109.07 51.24,109.07 50.76,109.55 RESET_BUTTON.3 49.16,109.58 49.09,109.51 48.71,109.51 48.64,109.58 RESET_BUTTON.4 47.23,109.55 47.02,109.55 45.95,108.48 | 47.78,104.5 47.78,106.02 46.12,107.68 46.12,108.31 45.95,108.48 | 47.78,104.5 47.78,103.88 IC1.1 | 45.95,108.48 45.43,109 R_RESET.2 | v10.25,51.66 10.25,46.26 U2.3 | v47.71,104.5 47.78,104.5
  Bottom 0.15: v10.25,51.66 10.25,53.67 14.13,57.55 14.13,70.91 v47.71,104.5
RTC_RST  (via drill 0.3)
  Top 0.15: v26.73,62.12 24.24,62.12 22.92,63.43 22.92,63.71 U2.16 | v78.81,62.12 79.64,62.12 80.61,61.15 80.61,60.87 U3.4
  Bottom 0.15: v78.81,62.12 v26.73,62.12
RX  (via drill 0.3)
  Top 0.15: v12.74,55.47 12.26,55.95 12.26,57.89 12.67,58.31 12.67,63.71 U2.24 | v12.74,41 2.77,31.02 TP2.TP
  Bottom 0.15: v12.74,41 v12.74,55.47
SCK  (via drill 0.3)
  Top 0.15: v7.06,91.89 6.72,91.55 5.96,91.55 J4.P5 | v10.25,88.71 10.25,81.02 16.2,75.07 TP8.TP 16.27,75 16.27,66.27 v16.69,65.86 | U1.6 43.28,55.19 43.28,54.91 44.74,53.46 44.74,35.11 43.97,34.35 43.84,34.35 D10.2 43.97,34.28 43.97,31.23 R6.1 44.04,31.16 44.11,31.09 v44.8,31.09 | v86.08,14.61 86.08,15.37 J1.13 | v14.75,47.37 14.75,47.23 14.06,46.54 14.06,46.26 U2.6 14.06,46.19 14.06,45.9 17.99,41.97 v24.38,41.97
  Bottom 0.15: v10.25,88.71 v7.06,91.89 | v86.08,14.61 86.08,14.89 86.38,15.19 86.38,19 86.42,19.04 86.42,21.61 86.63,21.81 86.63,22.09 86.01,22.71 53.18,22.71 v44.8,31.09 44.74,31.09 33.86,41.97 v24.38,41.97 | v16.69,65.86 16.69,61.15 14.75,59.21 v14.75,47.37
SCL  (via drill 0.3)
  Top 0.15: v149.72,14.27 150.34,13.64 150.34,13.43 SENSOR2.4 | U4.7 134.97,48.82 135.25,48.82 135.53,48.55 135.53,47.65 135.29,47.42 v135.29,43.1 | v151.52,11.01 151.52,5.75 150.9,5.12 150.9,4.99 R2-PINH.1 | v160.45,21.26 165.23,21.26 J3.4 | v19.8,61.49 17.87,63.43 17.87,63.71 U2.20 | v32.76,51.38 v33.79,50.34 | v84.21,50.14 84.21,51.31 84.42,51.52 U3.16
  Bottom 0.15: 152.3,11.8 152.72,12.21 152.72,12.93 160.45,20.66 v160.45,21.26 | 152.3,11.8 v151.52,11.01 | 152.3,11.8 151.52,11.8 149.72,13.6 v149.72,14.27 142.38,21.61 140.81,21.61 136.19,26.22 136.19,42.2 v135.29,43.1 134.39,44 130.03,44 123.06,50.97 85.11,50.97 84.28,50.14 v84.21,50.14 82.41,48.34 81.58,48.34 79.57,50.34 v33.79,50.34 | v19.8,61.49 22.64,61.49 v32.76,51.38
SDA  (via drill 0.3)
  Top 0.15: v141.82,42.8 135.31,49.31 134.97,49.31 U4.8 | 146.35,15.37 141.82,19.9 141.82,21.86 v141.18,22.51 | R1-PINH.1 149.44,4.92 149.3,4.92 148.75,4.36 146.46,4.36 146.1,4.73 146.1,6.78 146.35,7.03 146.35,15.37 | v19.8,62.6 19.11,63.29 19.11,63.71 U2.19 | v83.1,49.72 83.1,51.52 U3.15 | J3.3 165.75,20.8 166.01,20.8 166.13,20.92 166.13,21.68 163.25,24.56 v153.2,24.56 | SENSOR2.3 149.22,13.74 149.22,13.94 148.76,14.4 147.32,14.4 146.35,15.37
  Bottom 0.15: 141.25,22.51 142.12,23.38 142.12,42.5 v141.82,42.8 140.92,43.7 135.31,43.7 130.95,48.06 126.38,48.06 123.2,51.24 84.69,51.24 83.17,49.72 v83.1,49.72 81.99,48.61 81.72,48.61 72.09,58.24 27.91,58.24 23.55,62.6 v19.8,62.6 | v153.2,24.56 151.13,22.48 141.52,22.48 141.55,22.51 141.25,22.51 | 141.25,22.51 v141.18,22.51
SRC  (via drill 0.3)
  Top 0.15: C4.2 96.33,33.03 92.73,33.03 90.86,31.16 D5.2 90.79,31.16 87.98,31.16 84.79,34.35 83.72,34.35 82.34,35.73 80.54,35.73 80.4,35.59 80.4,34.56 83.1,31.86 L1.1 83.24,31.92 82.87,31.55 v82.87,30.19 | v76.31,25.14 75.62,25.14 68.42,17.94 68.42,17.17 Q3.3
  Bottom 0.15: v82.87,30.19 77.81,25.14 v76.31,25.14
SS_SD  (via drill 0.3)
  Top 0.15: v11.22,101.66 11.08,101.52 10.39,101.52 R10.1 | v13.02,101.66 15.37,99.31 D8.2 | v11.15,55.19 11.43,54.91 11.43,46.26 U2.4 | v5.12,88.22 6.23,88.22 J4.P2
  Bottom 0.15: v11.22,101.66 v13.02,101.66 13.02,101.59 13.43,101.17 13.43,88.22 | v11.15,55.19 11.15,55.54 13.43,57.82 13.43,88.22 | 13.43,88.22 v5.12,88.22
TX  (via drill 0.3)
  Top 0.15: v11.43,56.51 11.43,63.71 U2.25 | v8.38,53.46 8.38,48.48 6.72,46.81 6.72,41.83 2.91,38.02 TP1.TP
  Bottom 0.15: v8.38,53.46 v11.43,56.51
USB_D+  (via drill 0.3)
  Top 0.15: v146.74,48.34 147.71,48.34 D1.1 | v45.98,59.62 v44.11,57.76 | v23.89,47.37 23.89,46.47 24.1,46.26 U2.14
  Bottom 0.15: v146.74,48.34 126.52,48.34 118.69,56.16 88.43,56.16 84.97,59.62 v45.98,59.62 | v44.11,57.76 40.51,57.76 30.33,47.58 24.1,47.58 v23.89,47.37
USB_D-  (via drill 0.3)
  Top 0.15: v23.27,47.37 23.27,46.6 22.92,46.26 U2.13 | D1.3 147.71,46.4 146.32,46.4 145.84,45.91 139.19,45.91 135.18,49.93 94.25,49.93 v94.11,50.07
  Bottom 0.15: v23.27,47.37 23.75,46.88 24.03,46.88 24.45,47.3 81.99,47.3 84.62,49.93 93.97,49.93 v94.11,50.07
VBAT
  Top 0.3: U4.2 132.96,48.82 132.96,48.41 U4.3 132.89,48.26 132.5,48.26 131.43,47.19 130.5,47.19 129.69,48.01 129.01,48.01 | 129.01,48.01 C2_BAT.1 128.87,47.99 126.66,47.99 126.03,47.37 MCP73831.3 125.9,47.44 125.41,47.92 115.99,47.92 108.44,40.37 108.44,2.29 109.21,1.52 110.31,1.52 111.42,2.63 113.92,2.63 TP3.TP | 129.01,48.01 130.82,46.2 Q1.3
VBUS
  Top 0.3: 150.27,43.84 150.27,44.53 C4_USB.1 150.34,44.67 151.17,45.5 151.17,46.81 150.62,47.37 150.27,47.37 D1.5 | 150.27,43.84 150.27,43.14 C5_USB.1 | 150.27,43.84 146.81,43.84 144.8,41.83 | 144.8,41.83 143.3,40.33 143.3,39.45 144.94,37.81 148.26,37.81 150.34,39.89 PFMF.050.1.2 | 123.06,47.02 121.33,47.02 CHG_LED.A 121.12,46.95 120.5,46.33 119.25,46.33 118.83,46.74 117.45,46.74 C1_BAT.1 117.45,46.6 117.45,37.46 D2.2 117.45,37.33 117.17,37.05 114.75,37.05 R1_PWRUSB.2 114.61,36.91 109.76,32.06 109.76,2.84 TP14.TP | 123.06,47.02 123.33,47.3 MCP73831.4 | 123.06,47.02 123.2,46.95 127.35,42.8 129.84,42.8 Q1.1 129.98,42.66 130.74,41.9 144.66,41.9 144.8,41.83
VRTC
  Top 0.3: C10_SUPERCAP.2 91.41,51.59 91.34,51.66 88.22,51.66 C8.1 88.09,51.8 85.87,51.8 82.85,54.82 | 82.85,54.82 82.85,59.48 82.59,59.74 82.59,64.16 R_CAPACITOR.1 | 82.85,54.82 82.85,52.88 81.89,51.92 U3.14
VUSB
  Top 0.3: J2.A9 163.64,56.78 163.64,56.58 J2.B4 163.78,56.51 164.33,56.51 165.53,55.31 165.53,53.34 164.26,52.08 163.78,52.08 J2.B9 163.64,52.01 163.64,51.8 J2.A4 163.5,51.73 160.11,51.73 150.41,42.03 147.99,42.03 145.91,39.96 PFMF.050.1.1